# EAGLE design hall_sensor100a (EAGLE 9.6.2)
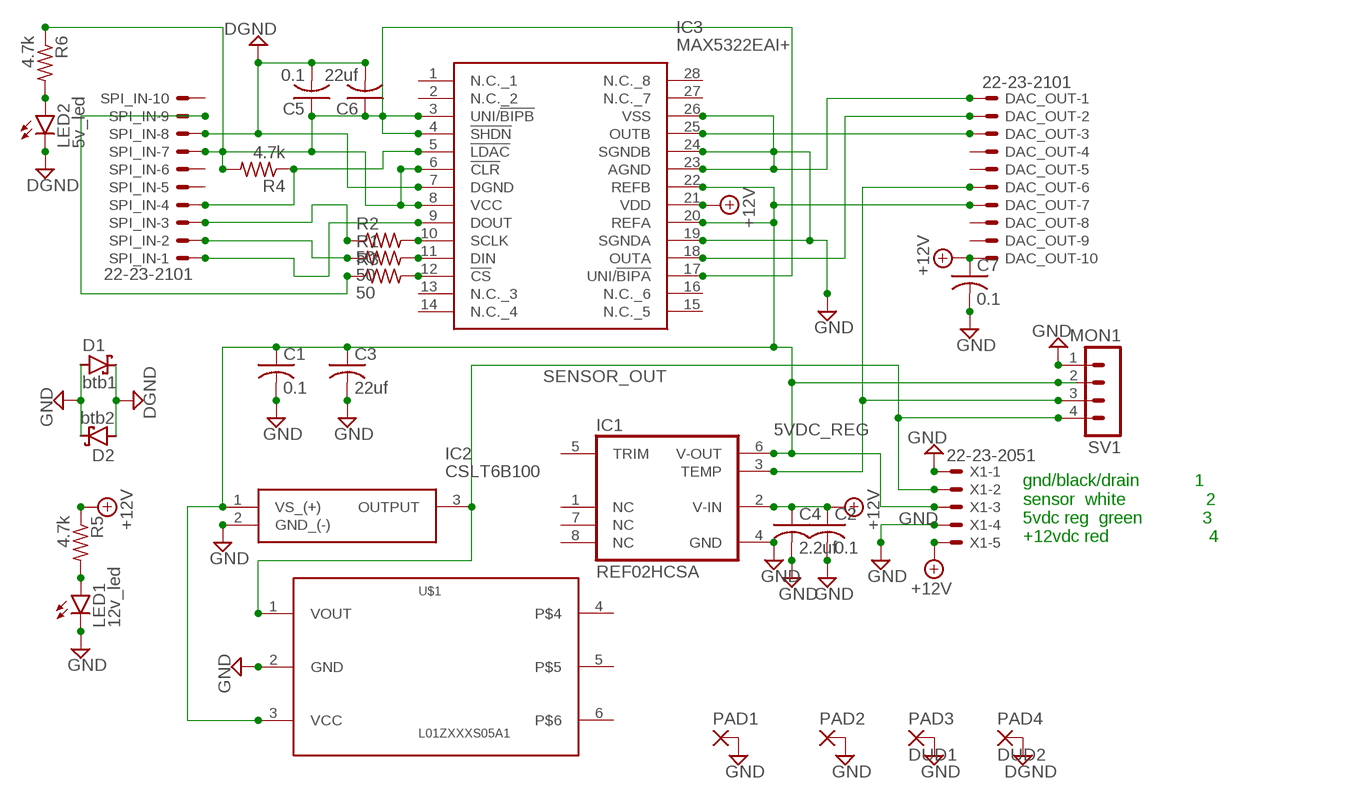
[diagram p0: schematic, sheet 1]

## Parts
C1  0.1  C-USC0805  [C0805]
C2  0.1  C-USC0805  [C0805]
C3  22uf  C-USC0805  [C0805]
C4  2.2uf  C-USC0805  [C0805]
C5  0.1  C-USC0805  [C0805]
C6  22uf  C-USC0805  [C0805]
C7  0.1  C-USC0805  [C0805]
D1  btb1  SCHOTTKY-DIODEDO35-7  [DO35-7]
D2  btb2  SCHOTTKY-DIODEDO35-7  [DO35-7]
DAC_OUT  22-23-2101  [22-23-2101]
IC1  REF02HCSA  [SO08]
IC2  CSLT6B100  [CSLT6B100]
IC3  MAX5322EAI+  [SOP65P778X199-28N]
LED1  12v_led  LEDCHIPLED_1206  [CHIPLED_1206]
LED2  5v_led  LEDCHIPLED_1206  [CHIPLED_1206]
PAD1  2,15/1,0  [2,15/1,0]
PAD2  2,15/1,0  [2,15/1,0]
PAD3  DUD1  2,15/1,0  [2,15/1,0]
PAD4  DUD2  2,15/1,0  [2,15/1,0]
R1  50  R-US_M0805  [M0805]
R2  50  R-US_M0805  [M0805]
R3  50  R-US_M0805  [M0805]
R4  4.7k  R-US_M0805  [M0805]
R5  4.7k  R-US_M0805  [M0805]
R6  4.7k  R-US_M0805  [M0805]
SPI_IN  22-23-2101  [22-23-2101]
SV1  MON1  MA04-1  [MA04-1]
U$1  L01ZXXXS05A1  [DIP2540W53P254L2900H508Q6B]
X1  22-23-2051  [22-23-2051]

## Nets
5VDC_REG [i-line]: C1.1 C3.1 DAC_OUT.7 IC1.6(V-OUT) IC2.1(VS_(+)) IC3.20(REFA) IC3.22(REFB) SV1.2 U$1.3(VCC) X1.3
+12V [i-line]: C2.1 C4.1 C7.1 DAC_OUT.10 IC1.2(V-IN) IC3.21(VDD) R5.1 X1.5
DGND [i-line]: C5.2 C6.2 D1.C D2.A IC3.7(DGND) LED2.C PAD4.1(P) SPI_IN.8
GND [i-line]: C1.2 C2.2 C3.2 C4.2 C7.2 D1.A D2.C DAC_OUT.1 IC1.4(GND) IC2.2(GND_(-)) IC3.19(SGNDA) IC3.23(AGND) IC3.24(SGNDB) IC3.26(VSS) LED1.C PAD1.1(P) PAD2.1(P) PAD3.1(P) SV1.1 U$1.2(GND) X1.1 X1.4
N$3: IC3.11(DIN) R1.2
N$4: DAC_OUT.2 IC3.18(OUTA)
N$5: DAC_OUT.3 IC3.25(OUTB)
N$6: R1.1 SPI_IN.2
N$7: IC3.9(DOUT) SPI_IN.1
N$8: R2.1 SPI_IN.3
N$9: R3.1 SPI_IN.9
N$10 [i-line]: C5.1 C6.1 IC3.3(UNI/!BIPB) IC3.4(!SHDN) IC3.6(!CLR) IC3.8(VCC) IC3.17(UNI/!BIPA) R4.2 R6.1 SPI_IN.7
N$11: LED1.A R5.2
N$12: IC3.5(!LDAC) R4.1 SPI_IN.4
N$13: IC3.10(SCLK) R2.2
N$14: IC3.12(!CS) R3.2
N$15: DAC_OUT.6 IC1.3(TEMP) SV1.3
N$16: LED2.A R6.2
SENSOR_OUT: IC2.3(OUTPUT) SV1.4 U$1.1(VOUT) X1.2
Unconnected: DAC_OUT.4 DAC_OUT.5 DAC_OUT.8 DAC_OUT.9 IC1.1(NC) IC1.5(TRIM) IC1.7(NC) IC1.8(NC) IC3.1(N.C._1) IC3.2(N.C._2) IC3.13(N.C._3) IC3.14(N.C._4) IC3.15(N.C._5) IC3.16(N.C._6) IC3.27(N.C._7) IC3.28(N.C._8) SPI_IN.5 SPI_IN.6 SPI_IN.10 U$1.4 U$1.5 U$1.6

## Notes on the sheet
- gnd/black/drain           1
  sensor  white                2
  5vdc reg  green            3
  +12vdc red                    4

## Library data of the parts
C1-C7 = rcl:C-US: CAPACITOR, American symbol; SPICEPREFIX: C
D1 D2 = diode:SCHOTTKY-DIODE: Schottky Diode
DAC_OUT SPI_IN = con-molex:22-23-2101: .100" (2.54mm) Center Header - 10 Pin; MF: MOLEX; MPN: 22-23-2101; OC_FARNELL: 1756828; OC_NEWARK: 94C0765
IC1 = maxim:REF02HCSA: VOLTAGE REFERENCE; OC_FARNELL: unknown; OC_NEWARK: unknown
IC2 = CSLT6B100:CSLT6B100: Board Mount Current Sensors 100A 4.5Vdcto10.5Vdc Induc Ana Curnt Sens Source: Datasheet <https://sensing.honeywell.com/honeywell-sensing-cslt-series-product-sheet-005862-2-en.pdf>; ALLIED_NUMBER: 70118743; ALLIED_PRICE-STOCK: https://www.alliedelec.com/honeywell-cslt6b100/70118743/; DESCRIPTION: Board Mount Current Sensors 100A 4.5Vdcto10.5Vdc Induc Ana Curnt Sens; HEIGHT: 6.3mm; MANUFACTURER_NAME: Honeywell; MANUFACTURER_PART_NUMBER: CSLT6B100; MOUSER_PART_NUMBER: 785-CSLT6B100; MOUSER_PRICE-STOCK: https://www.mouser.com/Search/Refine.aspx?Keyword=785-CSLT6B100
IC3 = MAX5322EAI+:MAX5322EAI+: Maxim MAX5322EAI+, 2-channel 12 bit Serial DAC, 28-Pin SSOP Source: Datasheet <https://componentsearchengine.com/Datasheets/2/MAX5322EAI .pdf>; DESCRIPTION: Maxim MAX5322EAI+, 2-channel 12 bit Serial DAC, 28-Pin SSOP; HEIGHT: 1.99mm; MANUFACTURER_NAME: Maxim Integrated; MANUFACTURER_PART_NUMBER: MAX5322EAI+; MOUSER_PART_NUMBER: 700-MAX5322EAI; MOUSER_PRICE-STOCK: https://www.mouser.com/Search/Refine.aspx?Keyword=700-MAX5322EAI; RS_PART_NUMBER: 7997645P; RS_PRICE-STOCK: http://uk.rs-online.com/web/p/products/7997645P
LED1 LED2 = led:LED: LED OSRAM: - CHIPLED LG R971, LG N971, LY N971, LG Q971, LY Q971, LO R971, LY R971 LH N974, LH R974 LS Q976, LO Q976, LY Q976 LO Q996 - Hyper CHIPLED LW Q18S LB Q993, LB Q99A, LB R99A - SideLED LS A670, LO A670, LY A670, LG A670, LP A670 LB A673, LV A673, LT A673, LW A673 LH A674 LY A675 LS A676, LA A676, LO A676, LY A676, LW A676 LS A679, LY A679, LG A679 - Hyper Micro SIDELED® LS Y876, LA Y876, LO Y876, LY Y876 LT Y87S - SmartLED LW L88C, LW L88S LB L89C, LB L89S, LG L890 LS L89K, LO L89K, LY L89K LS L896, LA L896, LO L896, LY L896 - TOPLED LS T670, LO T670, LY T670, LG T670, LP T670 LSG T670, LSP T670, LSY T670, LOP T670, LYG T670 LG T671, LOG T671, LSG T671 LB T673, LV T673, LT T673, LW T673 LH T674 LS T676, LA T676, LO T676, LY T676, LB T676, LH T676, LSB T676, LW T676 LB T67C, LV T67C, LT T67C, LS T67K, LO T67K, LY T67K, LW E67C LS E67B, LA E67B, LO E67B, LY E67B, LB E67C, LV E67C, LT E67C LW T67C LS T679, LY T679, LG T679 LS T770, LO T770, LY T770, LG T770, LP T770 LB T773, LV T773, LT T773, LW T773 LH T774 LS E675, LA E675, LY E675, LS T675 LS T776, LA T776, LO T776, LY T776, LB T776 LHGB T686 LT T68C, LB T68C - Hyper Mini TOPLED® LB M676 - Mini TOPLED Santana® LG M470 LS M47K, LO M47K, LY M47K Source: http://www.osram.convergy.de LUXEON: - LUMILED® LXK2-PW12-R00, LXK2-PW12-S00, LXK2-PW14-U00, LXK2-PW14-V00 LXK2-PM12-R00, LXK2-PM12-S00, LXK2-PM14-U00 LXK2-PE12-Q00, LXK2-PE12-R00, LXK2-PE12-S00, LXK2-PE14-T00, LXK2-PE14-U00 LXK2-PB12-K00, LXK2-PB12-L00, LXK2-PB12-M00, LXK2-PB14-N00, LXK2-PB14-P00, LXK2-PB14-Q00 LXK2-PR12-L00, LXK2-PR12-M00, LXK2-PR14-Q00, LXK2-PR14-R00 LXK2-PD12-Q00, LXK2-PD12-R00, LXK2-PD12-S00 LXK2-PH12-R00, LXK2-PH12-S00 LXK2-PL12-P00, LXK2-PL12-Q00, LXK2-PL12-R00 Source: www.luxeon.com KINGBRIGHT: KA-3528ASYC Source: www.kingbright.com
PAD1-PAD4 = wirepad:2,15/1,0: THROUGH-HOLE PAD
R1-R6 = rcl:R-US_: RESISTOR, American symbol; SPICEPREFIX: R
SV1 = con-lstb:MA04-1: PIN HEADER; OC_FARNELL: unknown; OC_NEWARK: unknown
U$1 = l01z:L01ZXXXS05
X1 = con-molex:22-23-2051: .100" (2.54mm) Center Header - 5 Pin; MF: MOLEX; MPN: 22-23-2051; OC_FARNELL: 1462952; OC_NEWARK: 38C9178

## Net classes
1 i-line: width 0.35 mm

## Board
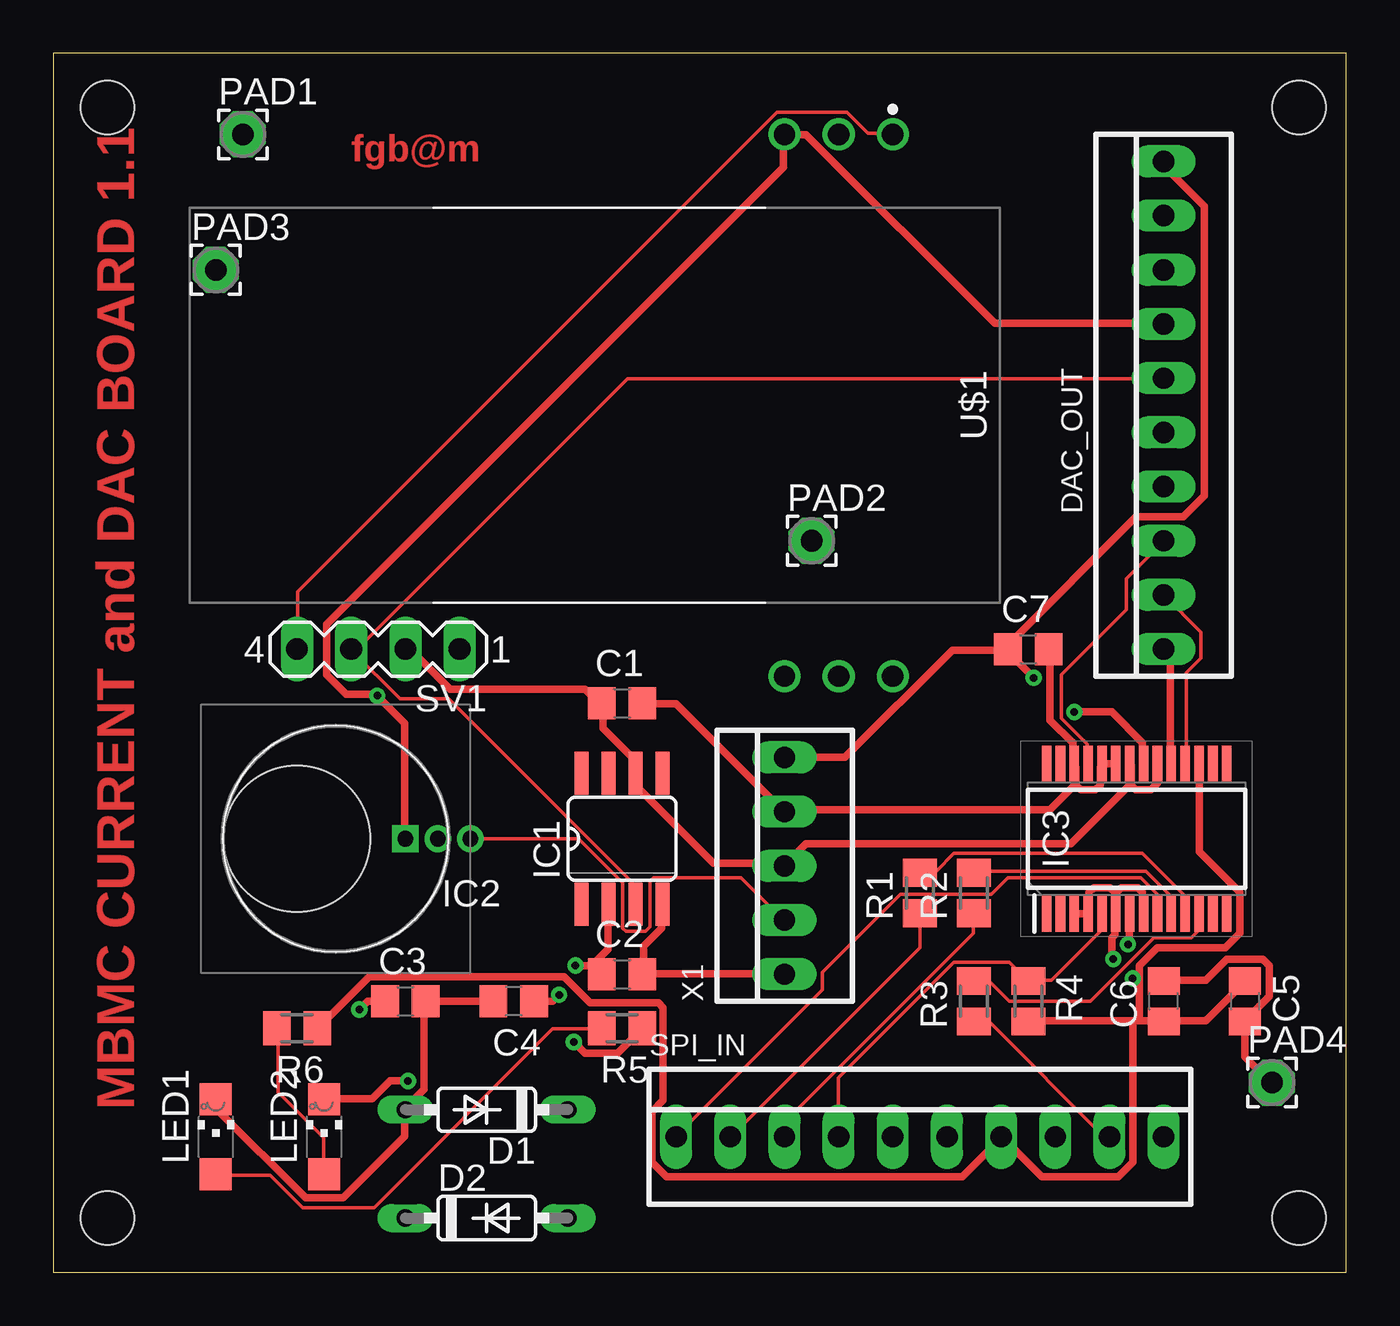
[diagram p1: board, top side]
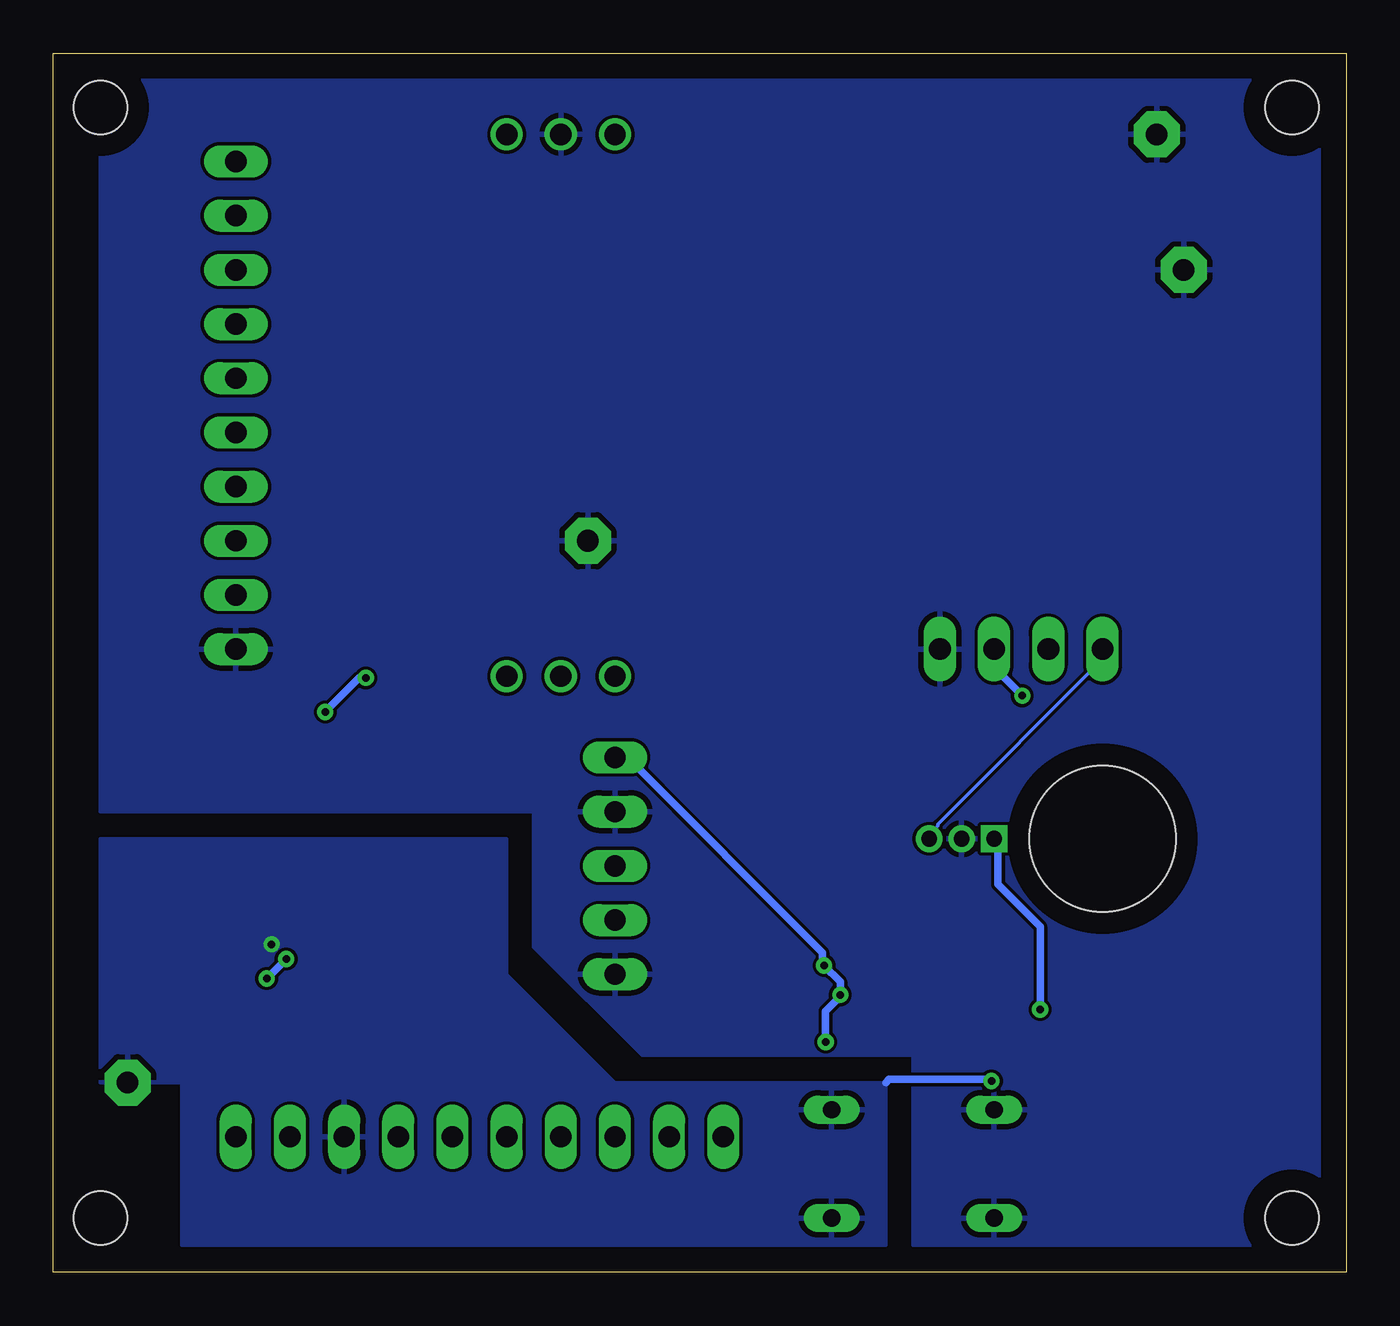
[diagram p2: board, bottom side, seen from below]

Size 60.63 x 57.14 mm. Coordinates in mm from the lower left corner, seen from the top.
Outline: 0,0 60.63,0 60.63,57.14 0,57.14 0,0
Copper layers (1*16): Top 0.035mm / dielectric 1.5mm / Bottom 0.035mm
Design rules "default": minimum track width 6mil, minimum drill 0.35mm, track to track 6mil, track to pad 6mil, pad to pad 6mil, via to via 6mil, smd to smd 6mil, copper to edge 40mil, drill to drill 6mil, minimum pad ring 10mil, minimum via ring 8mil, stop-mask expansion 4mil, vias tented up to drill 0mil, thermal gap 10mil
Holes 2.5 mm at 2.54,54.61 2.54,2.54 58.42,2.54 58.42,54.61
Holes 6.86 mm at 11.43,20.32

### Footprints (pad centres in the part's own frame; a part is rotated, then mirrored left to right if it is on the bottom)
C0805 = smd 1.3 x 1.5: 1 -0.95,0; 2 0.95,0
DO35-7 = drill 0.813 long: A 3.81,0; C -3.81,0
22-23-2101 = drill 1 long: 1 -11.43,0; 2 -8.89,0; 3 -6.35,0; 4 -3.81,0; 5 -1.27,0; 6 1.27,0; 7 3.81,0; 8 6.35,0; 9 8.89,0; 10 11.43,0
SO08 = smd 0.66 x 2.032: 1 -1.905,-3.073; 2 -0.635,-3.073; 3 0.635,-3.073; 4 1.905,-3.073; 5 1.905,3.073; 6 0.635,3.073; 7 -0.635,3.073; 8 -1.905,3.073
CSLT6B100 = drill 0.74 pad 1.1 square: 1 1.27,0 | drill 0.74 pad 1.1: 2 2.794,0; 3 4.318,0
SOP65P778X199-28N = smd 1.705 x 0.45: 1 -3.498,4.225; 2 -3.498,3.575; 3 -3.498,2.925; 4 -3.498,2.275; 5 -3.498,1.625; 6 -3.498,0.975; 7 -3.498,0.325; 8 -3.498,-0.325; 9 -3.498,-0.975; 10 -3.498,-1.625; 11 -3.498,-2.275; 12 -3.498,-2.925; 13 -3.498,-3.575; 14 -3.498,-4.225; 15 3.498,-4.225; 16 3.498,-3.575; 17 3.498,-2.925; 18 3.498,-2.275; 19 3.498,-1.625; 20 3.498,-0.975; 21 3.498,-0.325; 22 3.498,0.325; 23 3.498,0.975; 24 3.498,1.625; 25 3.498,2.275; 26 3.498,2.925; 27 3.498,3.575; 28 3.498,4.225
CHIPLED_1206 = smd 1.5 x 1.5: A 0,-1.75; C 0,1.75
2,15/1,0 = drill 1.016 pad 2.159 octagon: 1 0,0
M0805 = smd 1.3 x 1.6: 1 -0.95,0; 2 0.95,0
MA04-1 = drill 1.016 long: 1 -3.81,0; 2 -1.27,0; 3 1.27,0; 4 3.81,0
DIP2540W53P254L2900H508Q6B = drill 1 pad 1.343: 1 -12.7,2.54; 2 -12.7,0; 3 -12.7,-2.54; 4 12.7,-2.54; 5 12.7,0; 6 12.7,2.54
22-23-2051 = drill 1 long: 1 -5.08,0; 2 -2.54,0; 3 0,0; 4 2.54,0; 5 5.08,0

### Placement (x,y rotation side)
C1  26.67,26.67 0 top
C2  26.67,13.97 0 top
C3  16.51,12.7 0 top
C4  21.59,12.7 180 top
C5  55.88,12.7 270 top
C6  52.07,12.7 90 top
C7  45.72,29.21 0 top
D1  20.32,7.62 180 top
D2  20.32,2.54 0 top
DAC_OUT  52.07,40.64 90 top
IC1  26.67,20.32 0 top
IC2  15.24,20.32 0 top
IC3  50.8,20.32 90 top
LED1  7.62,6.35 0 top
LED2  12.7,6.35 0 top
PAD1  8.89,53.34 0 top
PAD2  35.56,34.29 0 top
PAD3  7.62,46.99 0 top
PAD4  57.15,8.89 0 top
R1  40.64,17.78 90 top
R2  43.18,17.78 90 top
R3  43.18,12.7 90 top
R4  45.72,12.7 270 top
R5  26.67,11.43 180 top
R6  11.43,11.43 180 top
SPI_IN  40.64,6.35 0 top
SV1  15.24,29.21 180 top
U$1  36.83,40.64 270 top
X1  34.29,19.05 90 top

### Tracks (layer width: path | path; a pad name or v marks a point on that pad's centre or on a via)
5VDC_REG  (via drill 0.35)
  Top 0.35: DAC_OUT.7 52.07,44.47 44.14,44.47 35.31,53.31 34.31,53.31 U$1.3 34.24,53.16 34.24,51.79 12.83,30.38 12.83,28.02 13.74,27.1 15.04,27.1 v15.19,27.03 16.48,25.73 16.48,20.32 IC2.1 | 50.55,22.83 50.55,23.75 IC3.22 | 50.55,22.83 50.77,22.61 51.46,22.61 51.77,22.91 51.77,23.75 IC3.20 | 50.55,22.83 50.39,22.76 47.73,20.09 35.31,20.09 34.31,19.1 X1.3 34.16,19.18 30.96,19.18 27.38,22.76 27.38,23.29 IC1.6 27.3,23.98 25.78,25.5 25.78,26.64 C1.1 25.55,26.72 24.94,27.33 18.62,27.33 16.79,29.16 16.56,29.16 SV1.2 | C3.1 14.73,12.7 v14.35,12.32
  Bottom 0.35: v14.35,12.32 14.35,16.2 16.33,18.19 16.33,20.17 16.48,20.32 IC2.1 | v15.19,27.03 16.48,28.32 16.48,29.16 SV1.2
+12V  (via drill 0.35)
  Top 0.35: C4.1 23.42,12.7 v23.72,13 | v24.49,14.38 25.32,14.38 25.71,14 C2.1 25.4,14.53 26.01,15.14 26.01,17.2 IC1.2 | v24.41,10.79 24.94,10.26 26.47,10.26 27.61,11.41 R5.1 | X1.5 37.14,24.13 42.16,29.16 44.75,29.16 C7.1 | v47.88,26.26 49.63,26.26 51.08,24.82 51.08,23.82 IC3.21 | v45.97,27.86 44.83,29.01 C7.1 | DAC_OUT.10 52.07,51.87 53.97,49.96 53.97,36.4 52.98,35.41 50.77,35.41 44.75,29.39 C7.1
  Bottom 0.35: v24.41,10.79 24.41,12.24 23.8,12.85 v23.72,13 23.72,13.61 v24.49,14.38 24.56,14.53 24.56,14.99 33.71,24.13 X1.5 | v47.88,26.26 46.28,27.86 v45.97,27.86
DGND  (via drill 0.35)
  Top 0.35: v16.64,8.97 15.8,8.97 14.96,8.13 12.75,8.13 LED2.C | PAD4.1 57.1,8.89 55.88,10.11 C5.2 55.96,11.86 57.02,12.93 57.02,14.38 56.72,14.68 55.04,14.68 54.05,13.69 52.07,13.69 C6.2 | v50.39,15.37 50.47,15.44 IC3.7
  Bottom 0.35: v16.64,8.97 16.71,9.04 21.44,9.04 21.59,8.89
  pour Bottom: 21.59,8.89 21.59,1.27 54.61,1.27 54.61,8.89 58.42,8.89 58.42,20.32 39.37,20.32 39.37,13.97 34.29,8.89
GND
  Top 0.35: IC3.23 49.78,23.82 49.25,23.82 IC3.24 49.1,23.67 49.1,22.83 48.87,22.61 48.18,22.61 47.95,22.83 | C7.2 46.74,29.16 46.74,25.88 47.8,24.82 47.8,23.82 IC3.26 47.95,23.67 47.95,22.83 | IC1.4 28.52,17.2 28.52,16.13 27.69,15.29 27.69,14 C2.2 27.84,14 34.24,14 X1.1 | C4.2 C3.2 17.4,12.55 17.4,8.59 16.56,7.75 D1.A 16.48,7.59 16.48,6.38 13.59,3.48 11.84,3.48 7.64,7.67 7.64,8.05 LED1.C | C1.2 27.69,26.64 29.21,26.64 34.24,21.61 X1.4 34.39,21.69 46.74,21.69 47.8,22.76 47.95,22.83 | IC3.19 52.38,23.82 52.38,28.85 52.07,29.16 DAC_OUT.1
  pour Bottom: 1.27,55.88 58.42,55.88 58.42,21.59 1.27,21.59
  pour Bottom: 1.27,22.86 1.27,1.27 20.32,1.27 20.32,10.16 33.02,10.16 38.1,15.24 38.1,22.86
N$3
  Top 0.152: R1.2 40.64,18.8 41.4,18.8 42.24,19.63 51.08,19.63 53.06,17.65 53.06,16.89 IC3.11
N$4
  Top 0.152: DAC_OUT.2 53.82,30 53.82,28.78 53.14,28.09 53.14,23.82 IC3.18
N$5
  Top 0.152: IC3.25 48.49,23.82 48.49,24.74 47.27,25.96 47.27,28.02 50.32,31.06 50.32,32.51 52.07,34.27 DAC_OUT.3
N$6
  Top 0.152: R1.1 40.64,15.21 31.8,6.38 SPI_IN.2
N$7
  Top 0.152: IC3.9 51.77,16.89 51.77,17.73 51,18.49 44.75,18.49 43.99,17.73 39.73,17.73 36.07,14.07 36.07,13.23 29.21,6.38 SPI_IN.1
N$8
  Top 0.152: R2.1 43.16,16.82 43.16,15.9 34.31,7.06 34.31,6.38 SPI_IN.3
N$9
  Top 0.152: R3.1 43.23,11.71 43.92,11.71 49.25,6.38 49.48,6.38 SPI_IN.9
N$10  (via drill 0.35)
  Top 0.35: IC3.3 48.49,16.82 IC3.4 48.56,16.97 48.56,17.8 48.79,18.03 49.55,18.03 49.78,17.8 | 49.78,17.8 49.78,16.89 IC3.6 49.78,16.66 49.78,15.82 49.63,15.67 49.63,14.76 v49.71,14.68 | IC3.8 51.08,16.89 51.08,17.8 50.85,18.03 50.09,18.03 49.94,17.88 49.78,17.8 | C5.1 55.88,13.61 54.05,11.79 52.07,11.79 C6.1 51.92,11.79 50.93,11.79 | 50.93,11.79 50.62,11.79 | 50.62,11.79 45.75,11.79 R4.2 | 50.93,11.79 50.93,13.77 | 50.93,13.77 50.93,14.38 51.77,15.21 54.97,15.21 55.65,15.9 55.65,17.8 53.75,19.71 53.75,23.75 IC3.17 | v50.62,13.77 50.93,13.77 | R6.1 12.45,11.48 14.81,13.84 23.95,13.84 25.17,12.62 28.37,12.62 28.6,12.39 28.6,8.05 28.07,7.52 28.07,5.16 28.75,4.47 42.62,4.47 44.45,6.3 SPI_IN.7 44.6,6.22 46.36,4.47 49.94,4.47 50.62,5.16 50.62,11.79
  Bottom 0.35: v50.62,13.77 v49.71,14.68
N$11
  Top 0.152: LED1.A 7.64,4.55 10.16,4.55 11.68,3.02 15.04,3.02 23.42,11.41 25.71,11.41 R5.2
N$12
  Top 0.152: IC3.5 49.17,16.05 46.81,13.69 45.75,13.69 R4.1 45.67,13.69 44.83,14.53 42.24,14.53 36.83,9.12 SPI_IN.4
N$13
  Top 0.152: R2.2 43.23,18.8 51.23,18.8 52.38,17.65 52.38,16.89 IC3.10
N$14
  Top 0.152: R3.2 43.23,13.61 43.92,13.61 44.83,12.7 48.64,12.7 51.61,15.67 53.36,15.67 53.67,15.98 53.67,16.82 IC3.12
N$15
  Top 0.152: IC1.3 27.3,18.11 18.54,26.87 16.26,26.87 13.97,29.16 SV1.3 14.12,29.08 26.92,41.89 52.07,41.89 DAC_OUT.6
N$16
  Top 0.152: LED2.A 12.67,4.62 12.67,6.3 10.54,8.43 10.54,11.41 R6.2
SENSOR_OUT
  Top 0.152: IC2.3 24.64,20.32 26.69,18.26 26.69,16.13 26.85,15.98 27.76,15.98 27.99,16.2 27.99,18.34 28.14,18.49 32.26,18.49 34.24,16.51 X1.2 | U$1.1 39.34,53.39 38.2,53.39 37.21,54.38 33.93,54.38 11.45,31.9 11.45,29.24 SV1.4
  Bottom 0.152: IC2.3 19.53,20.32 19.53,20.55 19.15,20.93 19.15,21.01 11.45,28.7 11.45,29.16 SV1.4

### Text on the board
Top: fgb@m | MBMC CURRENT and DAC BOARD 1.1